# Altium schematic sheet MicroController.SchDoc
size B; SheetNumber: 4; SheetTotal: 12
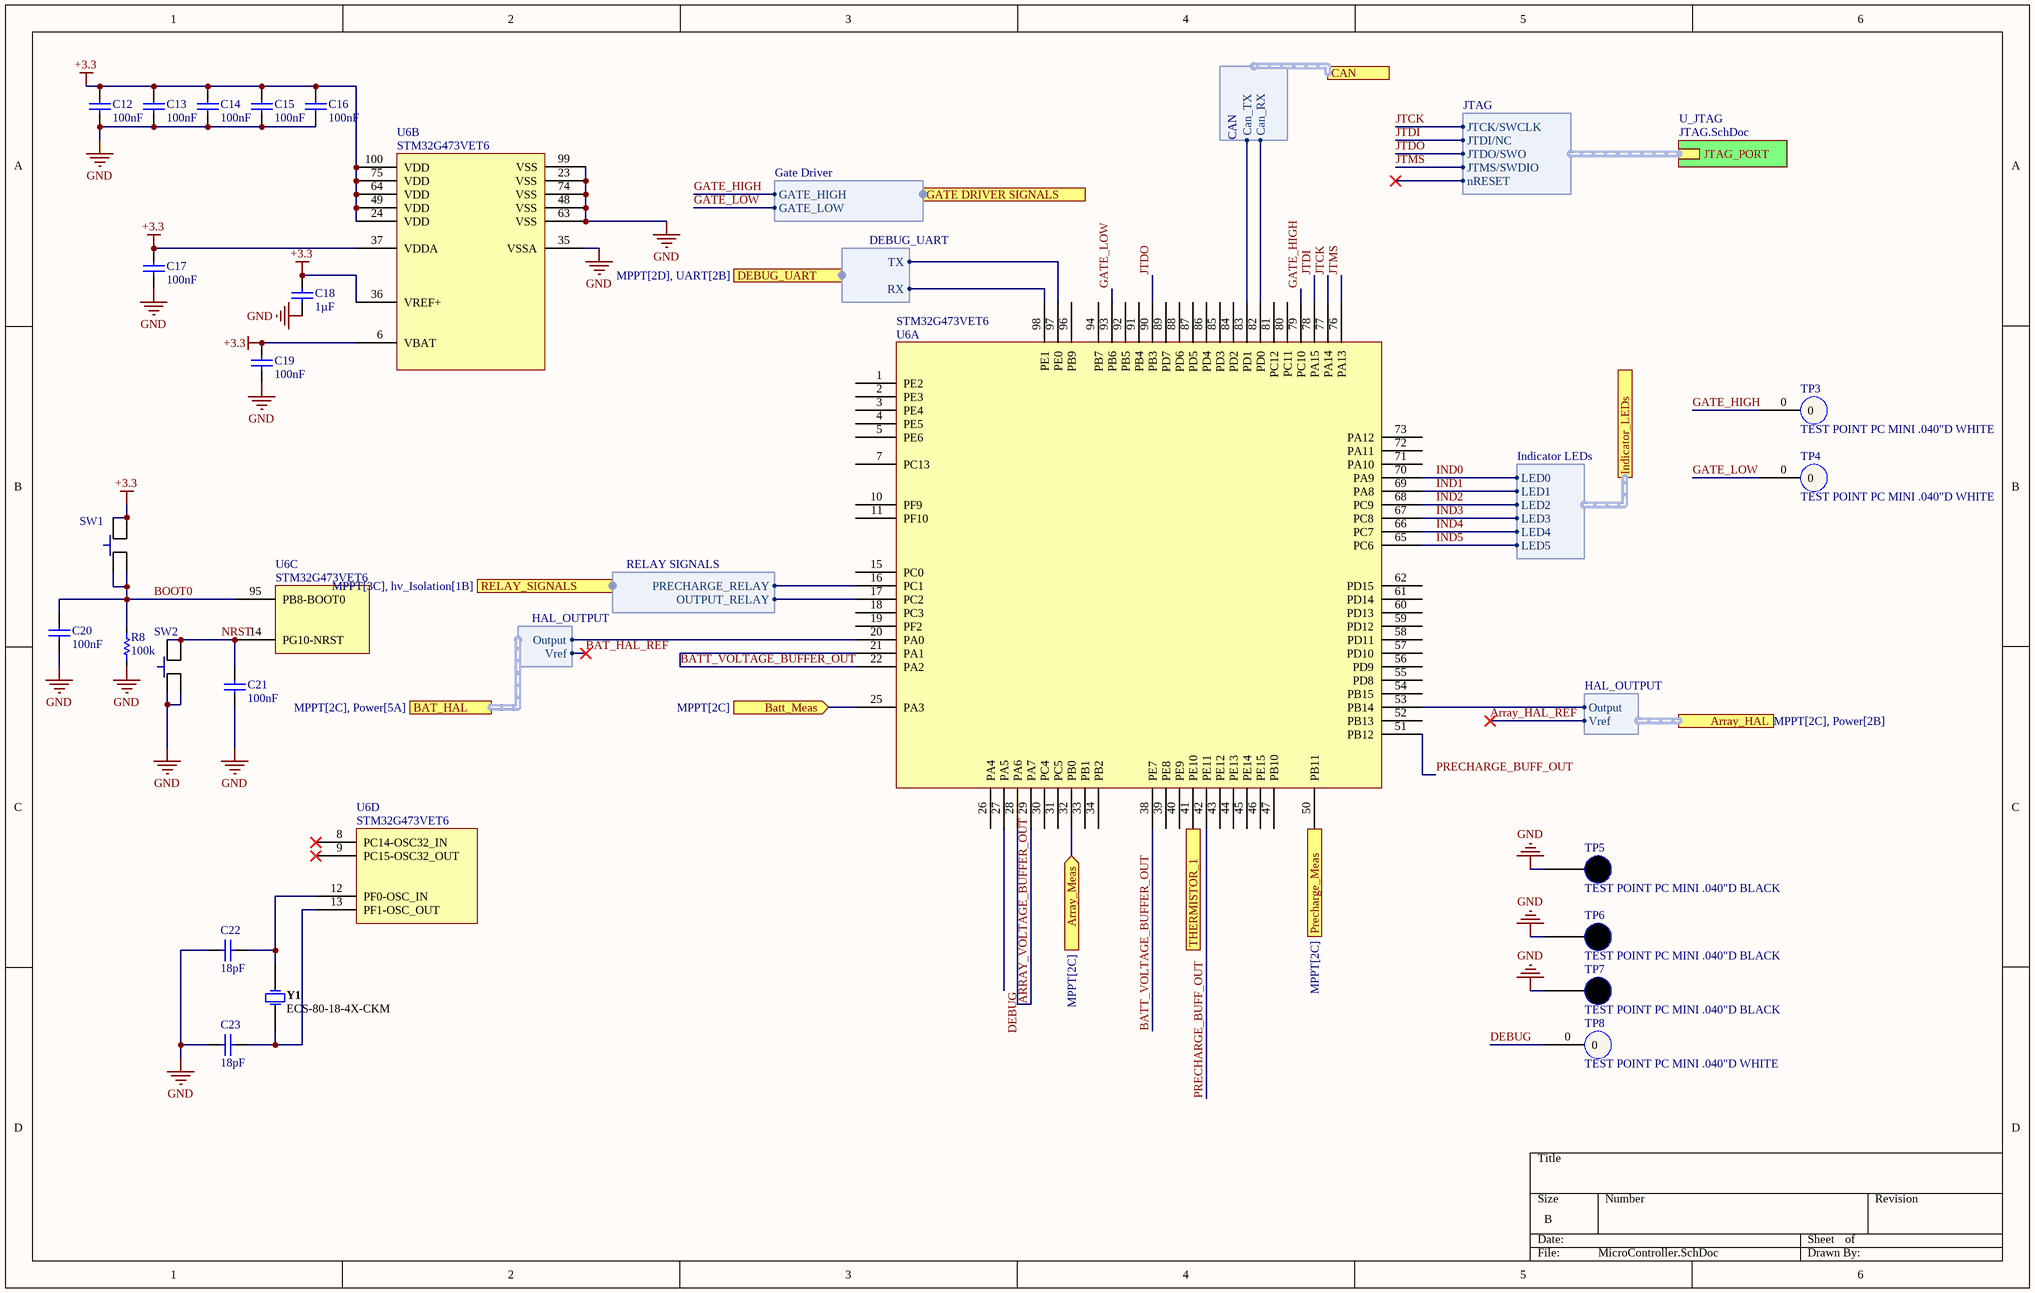
[diagram p0: MicroController.SchDoc]

## Parts
C12  value 100nF  [CAPC1608X90X40ML10T20]  (hidden comment: Capacitor 0.1uF +/-10% 50 V 0603)
C13  value 100nF  [CAPC1608X90X40ML10T20]  (hidden comment: Capacitor 0.1uF +/-10% 50 V 0603)
C14  value 100nF  [CAPC1608X90X40ML10T20]  (hidden comment: Capacitor 0.1uF +/-10% 50 V 0603)
C15  value 100nF  [CAPC1608X90X40ML10T20]  (hidden comment: Capacitor 0.1uF +/-10% 50 V 0603)
C16  value 100nF  [CAPC1608X90X40ML10T20]  (hidden comment: Capacitor 0.1uF +/-10% 50 V 0603)
C17  value 100nF  [CAPC1608X90X40ML10T20]  (hidden comment: Capacitor 0.1uF +/-10% 50 V 0603)
C18  value 1µF  [0805_Capacitor]  (hidden comment: CAP 0805 1uF 50V)
C19  value 100nF  [CAPC1608X90X40ML10T20]  (hidden comment: Capacitor 0.1uF +/-10% 50 V 0603)
C20  value 100nF  [CAPC1608X90X40ML10T20]  (hidden comment: Capacitor 0.1uF +/-10% 50 V 0603)
C21  value 100nF  [CAPC1608X90X40ML10T20]  (hidden comment: Capacitor 0.1uF +/-10% 50 V 0603)
C22  value 18pF  [0603_CAPACITOR]  (hidden comment: Capacitor 18pF 0603 50V 10%)
C23  value 18pF  [0603_CAPACITOR]  (hidden comment: Capacitor 18pF 0603 50V 10%)
R8  value 100k  [0603_RESISTOR]  (hidden comment: Res 0603 100K ohm 1%)
SW1  SW_TACT_SWITCH_6x6  [TACT_SWITCH_6x6_J-LEAD]  (value not drawn)
SW2  SW_TACT_SWITCH_6x6  [TACT_SWITCH_6x6_J-LEAD]  (value not drawn)
TP3  TEST POINT PC MINI .040"D WHITE  [TEST POINT 0.040" WHITE]
TP4  TEST POINT PC MINI .040"D WHITE  [TEST POINT 0.040" WHITE]
TP5  TEST POINT PC MINI .040"D BLACK  [TEST POINT 0.040" BLACK]
TP6  TEST POINT PC MINI .040"D BLACK  [TEST POINT 0.040" BLACK]
TP7  TEST POINT PC MINI .040"D BLACK  [TEST POINT 0.040" BLACK]
TP8  TEST POINT PC MINI .040"D WHITE  [TEST POINT 0.040" WHITE]
U6  STM32G473VET6  [TSQFP50P1600X1600X160-100N]  (parts A,B,C,D of 4)
Y1  ECS-80-18-4X-CKM  [ECS-80-18-4X-CKM-Footprint-1]

## Sub-sheets
U_JTAG = JTAG.SchDoc: JTAG_PORT (harness JTAG)

## Ports
Array_HAL (harness HAL_OUTPUT, see MPPT[2C], Power[2B]), Array_Meas (in, see MPPT[2C]), BAT_HAL (harness HAL_OUTPUT, see MPPT[2C], Power[5A]), Batt_Meas (in, see MPPT[2C]), CAN (harness CAN, see MPPT[3C], CanTrans[1B]), DEBUG_UART (harness DEBUG_UART, see MPPT[2D], UART[2B]), GATE DRIVER SIGNALS (harness Gate Driver, see MPPT[2C], GateDriver[1B]), Indicator_LEDs (harness Indicator LEDs, see MPPT[3C], indicator_leds[1B]), Precharge_Meas (in, see MPPT[2C]), RELAY_SIGNALS (harness RELAY SIGNALS, see MPPT[3C], hv_Isolation[1B]), THERMISTOR_1 (in, see MPPT[2C], temp_measure[1A])

## Harnesses
CAN: Can_RX, Can_TX
JTAG: JTCK/SWCLK, JTDI/NC, JTDO/SWO, JTMS/SWDIO, nRESET
Gate Driver: GATE_HIGH, GATE_LOW
RELAY SIGNALS: PRECHARGE_RELAY, OUTPUT_RELAY
Indicator LEDs: LED0, LED1, LED2, LED3, LED4, LED5
HAL_OUTPUT: Output, Vref
DEBUG_UART: TX, RX

## Nets
+3.3: C12.2 C13.2 C14.2 C15.2 C16.2 C17.2 C18.1 C19.2 SW1.2 SW1.3 U6.6(VBAT) U6.24(VDD) U6.36(VREF+) U6.37(VDDA) U6.49(VDD) U6.64(VDD) U6.75(VDD) U6.100(VDD)
GND: C12.1 C13.1 C14.1 C15.1 C16.1 C17.1 C18.2 C19.1 C20.1 C21.1 C22.1 C23.1 R8.1 SW2.1 SW2.4 TP5.0 TP6.0 TP7.0 U6.23(VSS) U6.35(VSSA) U6.48(VSS) U6.63(VSS) U6.74(VSS) U6.99(VSS)
Array_HAL_REF: port Array_HAL.Vref
Array_Meas: U6.32(PB0) ; port Array_Meas
ARRAY_VOLTAGE_BUFFER_OUT: U6.28(PA6) U6.29(PA7)
BAT_HAL_REF: port BAT_HAL.Vref
Batt_Meas: U6.25(PA3) ; port Batt_Meas
BATT_VOLTAGE_BUFFER_OUT: U6.21(PA1) U6.22(PA2) U6.38(PE7)
BOOT0: C20.2 R8.2 SW1.1 SW1.4 U6.95(PB8-BOOT0)
DEBUG: TP8.0 U6.27(PA5)
GATE_HIGH: TP3.0 U6.79(PC10) ; port GATE DRIVER SIGNALS.GATE_HIGH
GATE_LOW: TP4.0 U6.93(PB6) ; port GATE DRIVER SIGNALS.GATE_LOW
IND0: U6.70(PA9) ; port Indicator_LEDs.LED0
IND1: U6.69(PA8) ; port Indicator_LEDs.LED1
IND2: U6.68(PC9) ; port Indicator_LEDs.LED2
IND3: U6.67(PC8) ; port Indicator_LEDs.LED3
IND4: U6.66(PC7) ; port Indicator_LEDs.LED4
IND5: U6.65(PC6) ; port Indicator_LEDs.LED5
JTCK: U6.77(PA14) ; sheet U_JTAG/JTAG_PORT.JTCK/SWCLK
JTDI: U6.78(PA15) ; sheet U_JTAG/JTAG_PORT.JTDI/NC
JTDO: U6.90(PB3) ; sheet U_JTAG/JTAG_PORT.JTDO/SWO
JTMS: U6.76(PA13) ; sheet U_JTAG/JTAG_PORT.JTMS/SWDIO
NRST: C21.2 SW2.2 SW2.3 U6.14(PG10-NRST)
PRECHARGE_BUFF_OUT: U6.42(PE11) U6.51(PB12)
Precharge_Meas: U6.50(PB11) ; port Precharge_Meas
THERMISTOR_1: U6.41(PE10) ; port THERMISTOR_1
NetC22_2: C22.2 U6.12(PF0-OSC_IN) Y1.2
NetC23_2: C23.2 U6.13(PF1-OSC_OUT) Y1.1
NetU6_16: U6.16(PC1) ; port RELAY_SIGNALS.PRECHARGE_RELAY
NetU6_17: U6.17(PC2) ; port RELAY_SIGNALS.OUTPUT_RELAY
NetU6_20: U6.20(PA0) ; port BAT_HAL.Output
NetU6_53: U6.53(PB14) ; port Array_HAL.Output
NetU6_82: U6.82(PD0) ; port CAN.Can_RX
NetU6_83: U6.83(PD1) ; port CAN.Can_TX
NetU6_97: U6.97(PE0) ; port DEBUG_UART.TX
NetU6_98: U6.98(PE1) ; port DEBUG_UART.RX

Not connected (* = marked no-connect by the designer): U6 1(PE2) 2(PE3) 3(PE4) 4(PE5) 5(PE6) 7(PC13) 8(PC14-OSC32_IN)* 9(PC15-OSC32_OUT)* 10(PF9) 11(PF10) 15(PC0) 18(PC3) 19(PF2) 26(PA4) 30(PC4) 31(PC5) 33(PB1) 34(PB2) 39(PE8) 40(PE9) 43(PE12) 44(PE13) 45(PE14) 46(PE15) 47(PB10) 52(PB13) 54(PB15) 55(PD8) 56(PD9) 57(PD10) 58(PD11) 59(PD12) 60(PD13) 61(PD14) 62(PD15) 71(PA10) 72(PA11) 73(PA12) 80(PC11) 81(PC12) 84(PD2) 85(PD3) 86(PD4) 87(PD5) 88(PD6) 89(PD7) 91(PB4) 92(PB5) 94(PB7) 96(PB9)

## Library data of the parts
C12-C17 C19-C21 = CMP-001-00017-10: Chip Capacitor, 0.1uF, +/- 10%, 50 V, 0603 (1608 Metric); Capacitor Type: Ceramic; Voltage Rating: 50V; Min Operating Temperature: -55°C; Max Operating Temperature: 125°C; Mounting Technology: SMT; Tolerance: 10%; Pins: 2; Case/Package: 0603
C18 = CMP-001-00098-1: Tolerance: 10%; Capacitor Type: Ceramic; Voltage Rating: 50V; Case/Package: 0805; Mounting Technology: SMT
C22 C23 = CMP-001-00108-2: Capacitor 18pF ceramic 0603 10% 50V; Voltage Rating: 50V; Tolerance: 10%; Case/Package: 0603; Mounting Technology: SM; Capacitor Type: Ceramic
R8 = CMP-058-000032-7: RES 100K OHM 1/16W 1% 0603 SMD; Power: 62.5mW; Pins: 2; Case/Package: 0603; Mounting Technology: SMD; Tolerance: 1%
SW1 SW2 = CMP-050-000002-1: SWITCH TACT 6MM BLACK 160GF; SVP Creator: Spencer Berglund; Design Item ID: SW_TACT_SWITCH_6x6; Source: misc.SchLib; Package: 6mm x 6mm
TP3 TP4 TP8 = CMP-113-000002-1: Design Item ID: TEST POINT PC MINI .040"D WHITE; Source: Common.SchLib
TP5-TP7 = CMP-054-000001-1: Design Item ID: TEST POINT PC MINI .040"D BLACK; Source: misc.SchLib
U6 = CMP-00014-7: RISC Microcontroller, 32-Bit, 170MHz; Nominal Supply Voltage: 3.3V; RAM Size: 128; Frequency: 170Hz; Interface: JTAG; Pins: 100; RoHS Compliant: Yes; Case/Package: LQFP100; Mounting Technology: SMD
Y1 = CMP-003-00032-1: Crystal 8MHz ±10ppm (Tol) ±10ppm (Stability) 18pF FUND 80Ohm 2-Pin HC-49/USX Thru-Hole Bulk; ESR: 80; Pins: 2; Frequency: 8MHz; Case/Package: HC-49/USX; Load Capacitance: 18pF; Mounting Technology: TH